# EAGLE board tablet (EAGLE 8.4.3), part 1 of 5
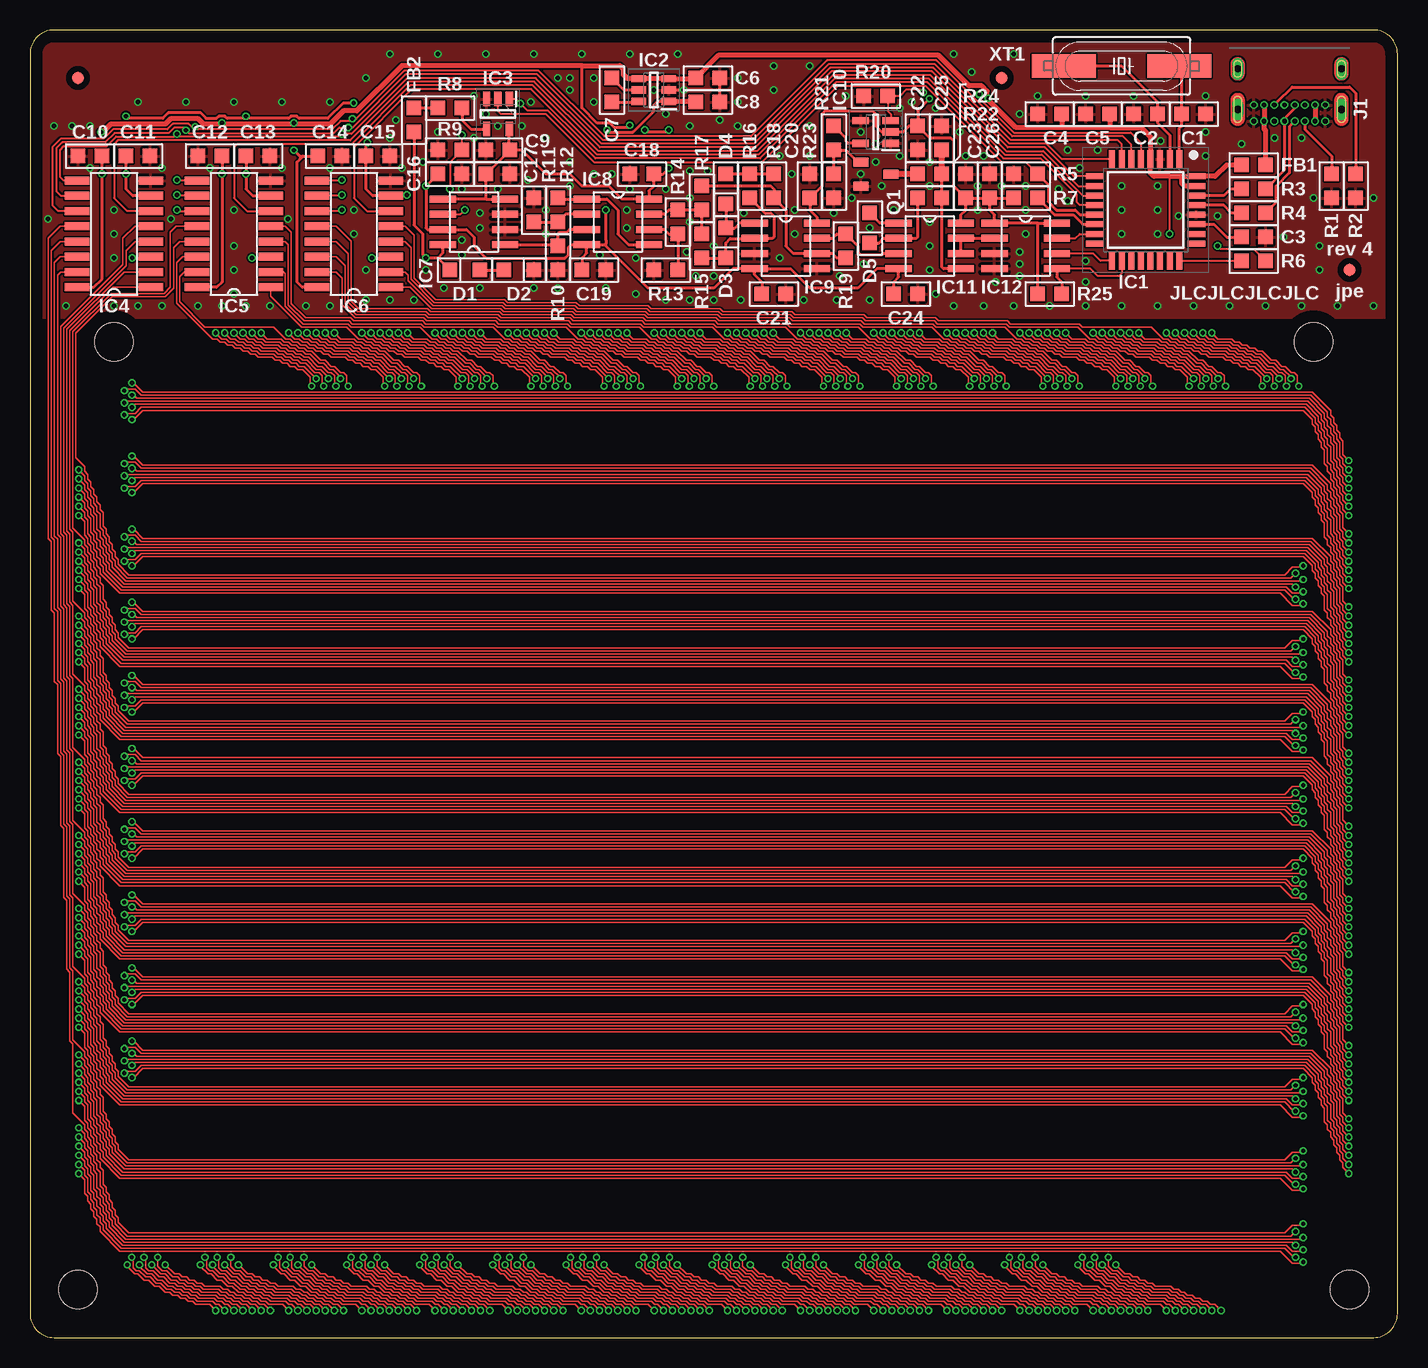
[diagram p5: board, top side]
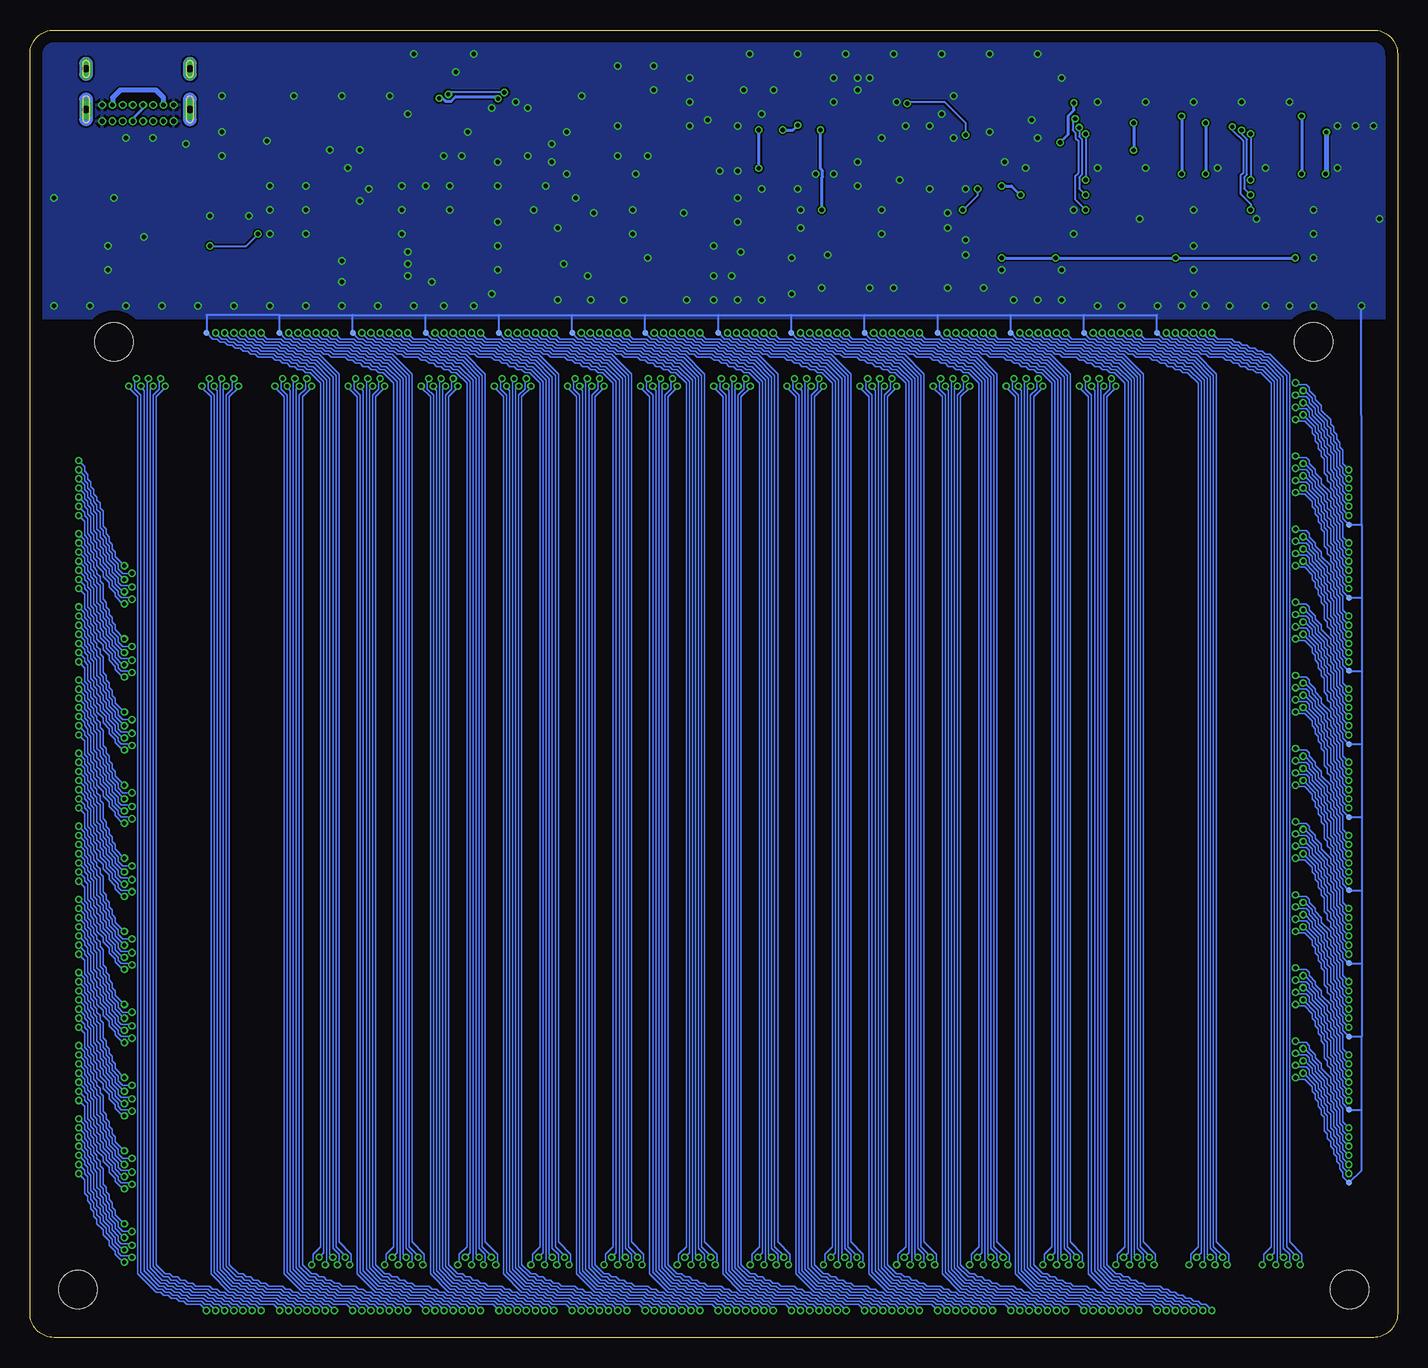
[diagram p6: board, bottom side, seen from below]

Size 114 x 109 mm. Coordinates in mm from the lower left corner, seen from the top.
Outline: 112,109 2,109 arc90 0,107 0,2 arc90 2,0 112,0 arc90 114,2 114,107 arc90 112,109
Copper layers (1*16): Top 0.035mm / dielectric 1.5mm / Bottom 0.035mm
Design rules "default *": minimum track width 5mil, minimum drill 0.35mm, track to track 5mil, track to pad 5mil, pad to pad 5mil, via to via 5mil, smd to smd 0mil, copper to edge 40mil, drill to drill 6mil, minimum pad ring 5mil, minimum via ring 5mil, stop-mask expansion 4mil, vias tented up to drill 14mil, thermal gap 10mil
Net classes: 0 default: width 0.152 mm, clearance 0.152 mm; 1 coil: width 0.127 mm, clearance 0.127 mm
Holes 3.2 mm at 110,4 4,4 7,83 107,83

## Footprints (pad centres in the part's own frame; a part is rotated, then mirrored left to right if it is on the bottom)
0805 = smd 1.2 x 1.2: 1 -1,0; 2 1,0
SOD323 = smd 1.2 x 1.2: 1 -1.25,0; 2 1.25,0
FIDUCIAL = smd 1 x 1: SPOT 0,0
QFP80P900X900X120-32N = smd 1.5 x 0.5: 1 -4.238,2.8; 2 -4.238,2; 3 -4.238,1.2; 4 -4.238,0.4; 5 -4.238,-0.4; 6 -4.238,-1.2; 7 -4.238,-2; 8 -4.238,-2.8; 17 4.238,-2.8; 18 4.238,-2; 19 4.238,-1.2; 20 4.238,-0.4; 21 4.238,0.4; 22 4.238,1.2; 23 4.238,2; 24 4.238,2.8 | smd 0.5 x 1.5: 9 -2.8,-4.238; 10 -2,-4.238; 11 -1.2,-4.238; 12 -0.4,-4.238; 13 0.4,-4.238; 14 1.2,-4.238; 15 2,-4.238; 16 2.8,-4.238; 25 2.8,4.238; 26 2,4.238; 27 1.2,4.238; 28 0.4,4.238; 29 -0.4,4.238; 30 -1.2,4.238; 31 -2,4.238; 32 -2.8,4.238
SOT95P280X145-6N = smd 1.2 x 0.6: 1 -1.25,0.95; 2 -1.25,0; 3 -1.25,-0.95; 4 1.25,-0.95; 5 1.25,0; 6 1.25,0.95
SOT95P280X145-5N = smd 1.2 x 0.6: 1 -1.25,0.95; 2 -1.25,0; 3 -1.25,-0.95; 4 1.25,-0.95; 5 1.25,0.95
SO16 = smd 0.66 x 2.032: 1 -4.445,-3.073; 2 -3.175,-3.073; 3 -1.905,-3.073; 4 -0.635,-3.073; 5 0.635,-3.073; 6 1.905,-3.073; 7 3.175,-3.073; 8 4.445,-3.073; 9 4.445,3.073; 10 3.175,3.073; 11 1.905,3.073; 12 0.635,3.073; 13 -0.635,3.073; 14 -1.905,3.073; 15 -3.175,3.073; 16 -4.445,3.073
SOIC8 = smd 0.6 x 2.2: 1 -1.905,-2.6; 2 -0.635,-2.6; 3 0.635,-2.6; 4 1.905,-2.6; 5 1.905,2.6; 6 0.635,2.6; 7 -0.635,2.6; 8 -1.905,2.6
SOT95P270X145-5N = smd 1.4 x 0.6: 1 -1.25,0.95; 2 -1.25,0; 3 -1.25,-0.95; 4 1.25,-0.95; 5 1.25,0.95
USB4085-GF-A = drill 0.4 pad 0.65: A1 2.975,-6.1; A4 2.125,-6.1; A5 1.275,-6.1; A6 0.425,-6.1; A7 -0.425,-6.1; A8 -1.275,-6.1; A9 -2.125,-6.1; A12 -2.975,-6.1; B1 -2.975,-4.75; B4 -2.125,-4.75; B5 -1.275,-4.75; B6 -0.425,-4.75; B7 0.425,-4.75; B8 1.275,-4.75; B9 2.125,-4.75; B12 2.975,-4.75 | drill 0.6 pad 0.9 long: S1 4.325,-5.12; S2 -4.325,-5.12; S3 -4.325,-1.74; S4 4.325,-1.74
SOT23_3 = smd 0.75 x 1.25: P$1 -1,-1.25; P$2 1,-1.25; P$3 0,1.25
2P = smd 0.508 x 0.508: 1 0,0; 2 0,0
HC49UP = smd 5.334 x 1.93: 1 -4.826,0; 2 4.826,0

## Placement (x,y rotation side)
C1  18pF  [0805]  97,102 0 top
C2  18pF  [0805]  93,102 180 top
C3  1uF  [0805]  102,91.75 180 top
C4  4.7uF  [0805]  85,102 180 top
C5  100nF  [0805]  89,102 180 top
C6  4.7uF  [0805]  56.5,105 0 top
C7  1uF  [0805]  48.5,104 270 top
C8  4.7uF  [0805]  56.5,103 180 top
C9  100nF  [0805]  39,99 180 top
C10  100nF  [0805]  5,98.5 180 top
C11  100nF  [0805]  9,98.5 180 top
C12  100nF  [0805]  15,98.5 180 top
C13  100nF  [0805]  19,98.5 180 top
C14  100nF  [0805]  25,98.5 0 top
C15  100nF  [0805]  29,98.5 180 top
C16  100nF  [0805]  35,97 0 top
C17  100nF  [0805]  39,97 0 top
C18  100nF  [0805]  51,97 180 top
C19  100nF  [0805]  47,89 180 top
C20  100nF  [0805]  65,96 90 top
C21  100nF  [0805]  62,87 180 top
C22  1uF  [0805]  74,100 270 top
C23  100nF  [0805]  78,96 90 top
C24  100nF  [0805]  73,87 180 top
C25  1nF C0G  [0805]  76,100 90 top
C26  100nF  [0805]  80,96 90 top
D1  5.1V Z  [SOD323]  36.25,89 180 top
D2  5.1V Z  [SOD323]  40.75,89 0 top
D3  1PS76SB70  [SOD323]  58,91.25 270 top
D4  1PS76SB70  [SOD323]  58,95.75 270 top
D5  1PS76SB70  [SOD323]  70,92.5 270 top
FB1  1K  [0805]  102,97.75 0 top
FB2  1K  [0805]  32,101.5 90 top
FD1  [FIDUCIAL]  4,105 0 top
FD2  [FIDUCIAL]  110,89 0 top
FD3  [FIDUCIAL]  81,105 0 top
IC1  ATMEGA16U2-AU  [QFP80P900X900X120-32N]  93,94 270 top
IC2  LM2776DBVR  [SOT95P280X145-6N]  52,104 180 top
IC3  SN74LVC1G125DBVT  [SOT95P280X145-5N]  39,102 270 top
IC4  4051D  [SO16]  7,92 90 top
IC5  4051D  [SO16]  17,92 90 top
IC6  4051D  [SO16]  27,92 90 top
IC7  DG419LEDY-T1-GE4  [SOIC8]  37,93 90 top
IC8  TSH82IDT  [SOIC8]  49,93 270 top
IC9  TSH82IDT  [SOIC8]  63,91 270 top
IC10  MCP1402T-E_OT  [SOT95P270X145-5N]  70.5,100.5 180 top
IC11  TSH82IDT  [SOIC8]  75,91 270 top
IC12  MCP3201  [SOIC8]  83,91 270 top
J1  USB4085-GF-A  [USB4085-GF-A]  105,107.5 0 top
Q1  BSS806NEH6327XTSA1  [SOT23_3]  70.5,97 270 top
R1  5.1K  [0805]  108.5,96 270 top
R2  5.1K  [0805]  110.5,96 270 top
R3  22R  [0805]  102,95.75 180 top
R4  22R  [0805]  102,93.75 180 top
R5  10K  [0805]  83,97 0 top
R6  10K  [0805]  102,89.75 0 top
R7  10K  [0805]  83,95 180 top
R8  150R  [0805]  35,102.5 180 top
R9  10K  [0805]  35,99 0 top
R10  10K  [0805]  44,90 90 top
R11  2.21K  [0805]  42,94 270 top
R12  27K  [0805]  44,94 90 top
R13  2.21K  [0805]  53,89 0 top
R14  27K  [0805]  54,93 90 top
R15  2.21K  [0805]  56,91 270 top
R16  2.21K  [0805]  60,96 90 top
R17  4.42K  [0805]  56,95 90 top
R18  2.21K  [0805]  62,96 90 top
R19  4.42K  [0805]  68,91 90 top
R20  10K  [0805]  70.5,103.5 0 top
R21  1R  [0805]  67,100 270 top
R22  22R  [0805]  75,95 0 top
R23  10K  [0805]  67,96 270 top
R24  1R  [0805]  75,97 0 top
R25  10K  [0805]  85,87 180 top
X0  2P  [2P]  99.29,83.75 0 bottom
X1  2P  [2P]  93.19,83.75 0 bottom
X2  2P  [2P]  87.1,83.75 0 bottom
X3  2P  [2P]  81,83.75 0 bottom
X4  2P  [2P]  74.91,83.75 0 bottom
X5  2P  [2P]  68.81,83.75 0 bottom
X6  2P  [2P]  62.72,83.75 0 bottom
X7  2P  [2P]  56.62,83.75 0 bottom
X8  2P  [2P]  50.52,83.75 0 bottom
X9  2P  [2P]  44.43,83.75 0 bottom
X10  2P  [2P]  38.33,83.75 0 bottom
X11  2P  [2P]  32.23,83.75 0 bottom
X12  2P  [2P]  26.14,83.75 0 bottom
X13  2P  [2P]  20.04,83.75 0 bottom
XT1  12MHz  [HC49UP]  91,106 0 top
Y0  2P  [2P]  4.06,12.9 0 bottom
Y1  2P  [2P]  4.06,19 0 bottom
Y2  2P  [2P]  4.06,25.09 0 bottom
Y3  2P  [2P]  4.06,31.19 0 bottom
Y4  2P  [2P]  4.06,37.28 0 bottom
Y5  2P  [2P]  4.06,43.38 0 bottom
Y6  2P  [2P]  4.06,49.48 0 bottom
Y7  2P  [2P]  4.06,55.57 0 bottom
Y8  2P  [2P]  4.06,61.67 0 bottom
Y9  2P  [2P]  4.06,67.77 0 bottom

## Tracks (layer width: path | path; a pad name or v marks a point on that pad's centre or on a via)
+5V  (via drill 0.35)
  Top 0.152: R6.2 102,90.75 99.25,90.75 v99,91 | v95,92 95,96.8
  Top 0.254: C26.1 80,94 80.4,93.6 IC12.1 84,92.91 | 85.75,93.06 IC12.8 84,92.91 | C23.1 78,94 77.6,93.6 IC11.8 | C22.1 73.25,101 72.75,100.5 IC10.2 71,100.5 70.5,101 70.5,102 70.25,102.25 66.25,102.25 66,102 66,96 C20.1 65,94 65.6,93.4 IC9.8 | R25.2 84,92.91 | 38,94.91 IC7.4 | 38,94.91 IC7.5 | 38,94.91 C17.1 C9.1 | C9.1 39.95,99.05 IC3.5 | IC4.16 5.3,87.56 6,88.25 v6,97 C10.1 | C12.1 v16,97 16,88 15.55,87.56 IC5.16 | 22.75,98.5 C14.1 | 22.5,98.25 22.75,98.5 | 22.5,98.25 22.25,98 22.25,88 22.7,87.56 IC6.16 | 16,101.15 v16,101.25 | 22,101.15 v22,101.25 | 22.75,98.5 22.47,98.5 v22,98.97 22.5,98.47 22.5,98.25 | C9.1 41,99 43,97 45,97 46,96 48.25,96 49.34,94.91 IC8.8 51.6,95.6 52,96 C18.1 52.78,97 v53.25,97.47 | C23.1 C26.1 | C26.1 R7.2 | C23.1 77,96 77,99.75 76.75,100 75,100 C22.1 | 80.03,103.03 80.03,103.17 v79.88,103.31 | v74.99,103.26 74,102.28 C22.1 | 46,106.03 46,102.52 47.27,101.25 48.34,101.25 48.69,100.9 49.83,100.9 v50,101.07 | v51.25,100.66 51.42,100.49 53.08,100.49 v53.25,100.66
  Top 0.406: v5.92,100.47 6.07,100.47 6.75,101.15 11.27,101.15 11.72,101.6 14.04,101.6 14.49,101.15 16,101.15 22,101.15 25.02,101.15 26.13,102.26 27.24,102.26 31.02,106.03 46,106.03 49.17,106.03 49.46,105.75 49.46,105.29 49.8,104.95 IC2.4 IC2.3 55.45,104.95 C6.1 57.39,106.89 75.73,106.89 78.28,104.35 79.35,104.35 79.79,103.91 79.79,103.27 80.03,103.03 82.19,100.87 86,100.87 | 96,96.8 IC1.32 98.8,96.8 99.75,97.75 FB1.1 | 96,96.8 95,96.8 93.7,96.8 93.4,97.1 IC1.4 93.4,100.1 92.63,100.87 90,100.87 | IC1.31 96.25,96 96,96.25 96,96.8 | 90,100.87 86,100.87 | C4.1 86,100.87 | C5.1 90,100.87
  Bottom 0.152: v99,91 96,91 v95,92
  Bottom 0.254: v16,101.25 v16,97 | v22,101.25 v22,98.97 | v79.88,103.31 79.64,103.31 79.38,103.05 78.89,103.05 78.5,103.44 75.17,103.44 v74.99,103.26 | v53.25,97.47 v53.25,100.66 | v51.25,100.66 50.41,100.66 v50,101.07
  Bottom 0.406: v5.92,100.47 5.92,97.08 v6,97
-5V  (via drill 0.35)
  Top 0.254: C24.2 72,88 72.4,88.4 IC11.4 70.59,89.09 69,87.5 65,87.5 63.41,89.09 IC9.4 | IC9.4 60.4,88.6 61,88 C21.2 | C19.2 46,90 46.4,90.4 IC8.4 | C16.1 v33,96 33,92.5 33.13,92.36 IC7.7 36.38,92.36 37,91.75 37,91 38,90 44.59,90 44.88,90.28 44.88,90.88 45.09,91.09 IC8.4 | C13.2 v18,97 18,95.75 18.57,95.17 IC5.7 | C11.2 v8,97 8,95.75 8.57,95.17 IC4.7 | IC8.4 47.91,91.09 | 47.91,91.09 48,91 | 48,91 51.5,87.5 57,87.5 58.59,89.09 IC9.4 | v31.42,95.25 31.34,95.17 IC6.7 28.57,95.17 28,95.75 C15.2 28,99.5 v28.12,99.62 | v26.97,102.92 26.11,102.92 24.82,101.63 22.44,101.63 22.24,101.83 21.76,101.83 21.56,101.63 18.18,101.63 v18,101.81 17.82,101.63 16.44,101.63 16.24,101.83 15.76,101.83 15.56,101.63 14.69,101.63 14.23,102.08 11.53,102.08 11.07,101.63 8.18,101.63 v8,101.81 | 47.91,91.09 48,91.19 | v48.1,100.66 48.28,100.49 50.25,100.49 52,102.24 52,102.75 52.3,103.05 IC2.1 | 48,91.19 48,91.5 v48,94 | 48,91 48,91.19
  Top 0.406: IC2.1 55.45,103.05 C8.2
  Bottom 0.254: v33,96 32.17,96 v31.42,95.25 | v26.97,102.92 26.97,102.33 27.46,101.84 27.46,100.29 v28.12,99.62 | v18,101.81 v18,97 | v8,101.81 v8,97 | v48.1,100.66 48.1,97.43 47.92,97.24 47.92,96.76 48,96.68 v48,94
CS_ADC
  Top 0.152: IC1.18 91,88.75 90.75,88.5 89,88.5 88.41,89.09 IC12.5
  Top 0.254: IC12.5 85.6,88.4 86,88 R25.1
ENA
  Top 0.152: IC1.9 87.02,96.8 84.6,99.22 81.5,99.22 75.18,105.55 66.82,105.55 60.49,99.22 47.51,99.22 42.04,104.69 31.58,104.69 26.69,99.81 7.3,99.81 7,99.5 7,95 8.1,93.91 IC4.6
ENB
  Top 0.152: IC5.6 18.09,93.91 17,95 17,99.25 17.25,99.5 26.82,99.5 31.7,104.38 41.91,104.38 47.38,98.91 60.62,98.91 66.95,105.24 75.05,105.24 81.38,98.91 84.47,98.91 87.39,96 IC1.10
ENC
  Top 0.152: IC6.6 28.09,93.91 27,95 27,99.25 31.83,104.08 41.78,104.08 47.25,98.61 60.75,98.61 67.08,104.94 74.92,104.94 81.25,98.61 84.34,98.61 87.75,95.2 IC1.11
GND  (via drill 0.35)
  Top 0.254: 57.5,104 v54.5,104 IC2.2 | 57.5,104 C6.2 | C8.1 57.5,104
  Bottom 0.152: 3,19 3,25.09 | 3,31.19 3,25.09 | 3,37.28 3,31.19 | 3,43.38 3,37.28 | 3,49.48 3,43.38 | 3,55.57 3,49.48 | 3,61.67 3,55.57 | 3,67.77 3,61.67 | 3,67.77 v3.01,86 | Y1.2 3,19 | Y2.2 3,25.09 | Y3.2 3,31.19 | Y4.2 3,37.28 | Y5.2 3,43.38 | Y6.2 3,49.48 | Y7.2 3,55.57 | Y8.2 3,61.67 | Y9.2 3,67.77 | X0.2 99.29,85.25 93.19,85.25 | X13.2 20.04,85.25 26.14,85.25 | 32.23,85.25 26.14,85.25 | 38.33,85.25 32.23,85.25 | 44.43,85.25 38.33,85.25 | 50.52,85.25 44.43,85.25 | 56.62,85.25 50.52,85.25 | 62.72,85.25 56.62,85.25 | 68.81,85.25 62.72,85.25 | 74.91,85.25 68.81,85.25 | 81,85.25 74.91,85.25 | 87.1,85.25 81,85.25 | 93.19,85.25 87.1,85.25 | X12.2 26.14,85.25 | X11.2 32.23,85.25 | X10.2 38.33,85.25 | X9.2 44.43,85.25 | X8.2 50.52,85.25 | X7.2 56.62,85.25 | X6.2 62.72,85.25 | X5.2 68.81,85.25 | X4.2 74.91,85.25 | X3.2 81,85.25 | X2.2 87.1,85.25 | X1.2 93.19,85.25 | Y0.2 3,13.96 3,19
  other vias: 7,86 9,86 11,86 14,86 16,86 20,86 28,86.5 30,86.5 32,86.5 25,86 23,86 5,97.5 11,97.5 15,97.5 21,97.5 25,97.5 30,100 31,97.5 34,100.5 37,100 39,101 38,102 41.5,96.5 48.5,97 47,97 34.5,87.5 37.5,87.5 42,87.5 44,87.5 48,87.5 50.5,90 36,95.75 62.5,90 68,103.5 65,98.5 63.5,97 69.25,97 70.5,99.5 69.25,100.5 71,96 68.5,95 67,93.75 50.5,87 53,86.5 55,86.5 57,86.5 59.25,86.5 64.5,86.5 67.25,86.5 70,86.5 75.5,87 75.5,102.5 77.5,100.5 72.5,98.5 78,98.5 79.5,98.5 79,96 81,96 83,96 82.5,90.5 82.5,89.5 82.5,88.5 77,86 79.5,86 82,86 85,86 88,86 91,86 94,86 97,86 100,86 103,86 106,86 109,86 112,86 37.5,92.5 37.5,93.75 43,100 45,98 41,101 41.75,103 88,89.75 86.5,99 89,99 82.5,102 84,103.5 88,103.5 92,103.5 98,103.5 98,100.5 98,98.5 101,99.5 95.75,93.5 99,93.5 91,92 94,92 94,94 94,96 91,96 91,94 75,93 75,91 75,89 63.75,94 63.75,92 18,86 1.5,93.25 7,90 7,92 7,94 17,94 17,91 17,89 17,87 11.75,93.25 21.5,93.25 27,92 28,89 27,94 9,103 13,103 17,103 21,103 25,103 30.5,101.5 28,105 30,107 34,107 38,107 42,107 46,107 50,107 44,105 47,105 47,103 52,104 54,107 53,102 55,101 57.5,101.5 59,103 59,105 62,104 62,106 65,106 59,101 65,101 62.5,98.5 75,98 75,96 72,94 79,94 83,94 83,92 80.5,88 88,88 107,95 112,95 77,107 78.5,105.5 82,107 73.5,103 72.5,102.5 70.5,98 70,92.5 67.5,88.5 69.5,89.5 55.5,88.5 57,88.5 57,91 54.75,90.5 55,93 55,95 53,95.75 55,97.25 56.5,97.25 59.5,93.75 49.75,94 49.75,92.5 45,96 50,95.75 39,95.75 43,94 43,92 47.5,90.25 32.75,98 36,91.5 36,90.25 33,89 2,101 3.5,101 5,101 45,105 45,104 104.5,91.75 107.5,91 107.5,89 94.25,99.75 87.5,97.5 103.75,100 106,100 85.75,95.75 86.5,94.75 37,103.5
  pour Bottom: 0,109 114,109 114,85 0,85
  pour Top: 0,109 114,109 114,85 0,85
MISO
  Top 0.152: IC12.6 88.64,90.36 89.24,89.76 IC1.17
N$1
  Top 0.254: IC1.1 95.8,100.8 96,101 C1.1 96,105.83 XT1.2
N$2
  Top 0.254: D1.1 D2.1
N$3
  Top 0.254: R8.1 36,101.5 36.75,100.75 IC3.4
N$4
  Top 0.254: IC8.2 44.63,93.64 R12.1 R11.2
N$5
  Top 0.254: R24.2 R22.2 76,89.25 76.16,89.09 IC11.5
  Top 0.508: R24.2 C25.1
N$6
  Top 0.254: IC1.27 98.7,92.8 99.75,91.75 C3.2
N$7
  Top 0.254: IC1.2 95,100.25 94,101.25 C2.1 94,103 91,106 XT1.1
N$8
  Top 0.406: J1.B4 J1.A9 102.88,100.75 103,100.62 FB1.2 | J1.B9 J1.A4
  Bottom 0.406: J1.B4 102.88,103.38 103.5,104 106.5,104 107.12,103.38 J1.B9
N$9
  Top 0.254: R15.1 R17.1 R14.2 53.25,94 52.88,93.64 IC8.7
N$11
  Top 0.254: R12.2 44.09,94.91 IC8.1 48.09,94.91 49,94 49,92 49.91,91.09 IC8.5
N$12
  Top 0.254: R16.1 61.25,93.75 61.75,93.75 62,93.5 62,91.75 61.88,91.64 IC9.2 60.39,91.62 58.37,91.62 58,91.25 D3.2 R15.2
N$13
  Top 0.254: J1.A5 106.28,100.72 108.5,98.5 R1.1
N$14
  Top 0.254: IC8.6 52.88,92.36 53.25,92 R14.1 R13.2
N$15
  Top 0.254: J1.B5 103.97,102.99 103.97,103 105.22,104.25 110,104.25 110.5,103.75 R2.1
N$18
  Top 0.254: IC9.1 59.16,92.91 58.75,92.5 D3.1 D4.2
N$19
  Top 0.254: R18.2 R16.2 D4.1
N$20
  Top 0.254: R19.1 67.25,90 66.89,90.36 IC9.6 63.63,90.36 63,91 63,94 R18.1 62,95.75 61.75,96 R17.2
N$22
  Top 0.254: Q1.P$1 69,98 68,99 R21.2 R23.1
N$23
  Top 0.254: IC11.1 70.84,92.91 D5.1
N$24
  Top 0.254: IC9.7 66.89,91.64 67.25,92 R19.2 69,91 69,90.5 69.25,90.25 71,90.25 71.11,90.36 IC11.3
N$25
  Top 0.254: D5.2 70.75,91.25 71.14,91.64 IC11.2 73.89,91.64 74,91.75 R22.1
N$26
  Top 0.254: R7.1 85.41,93.59 86.96,93.59 87.75,92.8 IC1.14
N$27
  Top 0.152: IC1.24 100.99,89.76 R6.1
N$28
  Top 0.254: IC11.6 IC11.7 IC12.2
N$29
  Top 0.254: IC1.29 99.5,94.4 100.15,93.75 R4.2
N$30
  Top 0.254: IC8.3 44.96,92.36 44.72,92.12 44.12,92.12 44,92 R10.2 43.91,91.09 IC7.1
N$31
  Top 0.254: IC1.30 99.5,95.2 100.05,95.75 R3.2
N$32
  Top 0.254: R3.1 104.58,97.33 J1.A7 104.58,101.62 105.42,102.47 J1.B7
N$33
  Top 0.254: R4.1 103.88,94.63 103.88,96 104.98,97.1 104.98,100.95 105.18,101.15 105.18,101.16 J1.A6
  Bottom 0.254: J1.B6 104.58,102.47 105.42,101.62 J1.A6
N$34
  Top 0.254: 72,97 Q1.P$3
  Top 0.508: R24.1 72,97
N$35
  Top 0.254: IC10.5 68.2,99.55 68,99.75 68,100 R21.1
N$36
  Top 0.254: IC2.5 49.5,104 C7.1
N$37
  Top 0.254: C7.2 50.7,103 IC2.6
N$39
  Top 0.254: R8.2 FB2.2
OUT
  Top 0.152: R5.2 83,98 81,98 74.67,104.33 67.33,104.33 61,98 47,98 43,102 39.25,102 39,102.25 IC3.2
  Top 0.254: IC1.13 87.53,93.6 87.13,93.99 85.58,93.99 84.88,94.69 84.88,96.12 R5.2
OUT_OE  (via drill 0.35)
  Top 0.152: IC3.1 40.5,103.25 v40.88,102.88 41.45,102.31 43.13,102.31 47.13,98.31 60.87,98.31 67.2,104.63 74.8,104.63 81.13,98.31 84.22,98.31 87.25,95.27 87.25,94.65 87.5,94.4 IC1.12 | v35,95.75 35,98 R9.2 v36,100.25 | IC7.6 35.87,93.64 v36.25,94
  Bottom 0.152: v35,95.75 35,95.25 v36.25,94 | v36,100.25 36,101.25 37.75,103 40.75,103 v40.88,102.88
PEAK_DRAIN  (via drill 0.35)
  Top 0.152: v79.13,103.63 79.13,103.31 82.01,100.44 91.75,100.44 92.6,99.59 IC1.5 | v74.45,103.8 74.23,104.02 73.02,104.02 72.5,103.5 R20.2 71.5,102.25 71.75,102 IC10.3
  Bottom 0.152: v74.45,103.8 78.97,103.8 v79.13,103.63
S0  (via drill 0.35)
  Top 0.152: IC1.6 91.8,99.45 91.12,100.13 81.88,100.13 75.56,106.46 66.44,106.46 60.12,100.13 47.88,100.13 42.41,105.6 31.2,105.6 27.19,101.6 v26.88,101.6 26.67,101.4 25.88,101.4 25.2,100.72 14,100.72 | v26,94 25.91,93.91 IC6.11 | IC4.11 2.35,93.91 1.89,94.36 1.89,99.25 2.58,99.94 6.14,99.94 6.93,100.72 11.45,100.72 11.9,101.17 13.23,101.17 13.68,100.72 14,100.72 | 14,100.72 13.77,100.94 v13.76,100.94 | v12.25,94 12.35,93.91 IC5.11
  Bottom 0.152: v26,94 26.84,94.83 26.84,96.85 26.61,97.07 26.61,99.76 26.84,100 26.84,100.42 27.07,100.65 27.07,101.41 v26.88,101.6 | v12.25,94 12.25,94.5 13.09,95.33 13.09,96.85 12.86,97.07 12.86,99.76 13.21,100.11 13.23,100.11 13.76,100.65 v13.76,100.94
S1  (via drill 0.35)
  Top 0.152: v26,95.25 25.93,95.17 IC6.10 | IC5.10 12.32,95.17 v12.25,95.25 | IC4.10 2.58,95.17 2.19,95.56 2.19,99.13 2.7,99.63 6.27,99.63 7.05,100.41 11.58,100.41 12.03,100.87 12.78,100.87 v13.01,100.64 13.23,100.41 25.33,100.41 25.78,100.87 v26.54,100.87 26.89,100.87 31.32,105.3 42.29,105.3 47.76,99.83 60.24,99.83 66.57,106.16 75.43,106.16 81.76,99.83 90.67,99.83 91,99.5 IC1.7
  Bottom 0.152: v26.54,100.87 26.54,100.12 26.3,99.89 26.3,96.95 26.53,96.72 26.53,95.78 v26,95.25 | v12.25,95.25 12.78,95.78 12.78,96.72 12.55,96.95 12.55,99.89 13.01,100.34 v13.01,100.64
S2  (via drill 0.35)
  Top 0.152: IC1.8 86.01,98.24 84.72,99.52 81.63,99.52 75.3,105.85 66.7,105.85 60.37,99.52 47.63,99.52 42.16,104.99 31.45,104.99 26.79,100.33 v26,100.33 25.77,100.11 12.48,100.11 v12.25,100.33 12.02,100.11 7.18,100.11 6.4,99.33 2.83,99.33 2.5,99 2.5,96.75 2.81,96.44 IC4.9 | v26,96.5 25.95,96.44 IC6.9 | v12.25,96.5 13.87,96.5 IC5.9
  Bottom 0.152: v26,100.33 v26,96.5 | v12.25,100.33 v12.25,96.5
SCLK
  Top 0.152: IC12.7 87.14,91.64 87.5,92 IC1.15
SIGNAL  (via drill 0.35)
  Top 0.254: IC7.8 34.4,90.4 34,90 | 34,90 v33,90 32.75,90.25 32.75,92 32,92.75 FB2.1 | v28.5,90 29.98,90 IC6.3 | v18.5,90 19.98,90 IC5.3 | v8.52,90 9.98,90 IC4.3 | D1.2 34,90
  Bottom 0.254: v33,90 v28.5,90 v18.5,90 v8.52,90
X0  (via drill 0.35 pad 0.6)
  Top 0.127: v88.75,6.69 88.88,6.57 88.88,5.8 89.13,5.55 89.51,5.55 90.02,5.04 90.4,5.04 90.91,4.54 91.29,4.54 91.54,4.28 91.92,4.28 92.18,4.03 92.56,4.03 92.81,3.77 93.19,3.77 93.45,3.52 94.72,3.52 94.97,3.26 95.35,3.26 95.61,3.01 95.86,3.01 96.12,2.76 96.5,2.76 v97,2.25 | v87.73,6.69 87.86,6.57 87.86,5.8 88.11,5.55 88.37,5.55 88.88,5.04 89.26,5.04 89.77,4.54 90.15,4.54 90.66,4.03 91.04,4.03 91.29,3.77 91.67,3.77 91.92,3.52 92.31,3.52 92.56,3.26 92.94,3.26 93.19,3.01 94.47,3.01 94.72,2.76 94.97,2.76 v95.48,2.25 | v87.35,6.06 87.35,5.93 87.99,5.3 88.24,5.3 88.75,4.79 89.13,4.79 89.64,4.28 90.02,4.28 90.53,3.77 90.91,3.77 91.16,3.52 91.54,3.52 91.8,3.26 92.18,3.26 92.43,3.01 92.81,3.01 93.07,2.76 94.21,2.76 v94.72,2.25 | v96.24,2.25 95.73,2.76 95.48,2.76 95.23,3.01 94.85,3.01 94.59,3.26 93.32,3.26 93.07,3.52 92.69,3.52 92.43,3.77 92.05,3.77 91.8,4.03 91.42,4.03 91.16,4.28 90.78,4.28 90.27,4.79 89.89,4.79 89.39,5.3 89,5.3 88.37,5.93 v88.37,6.06 | v97.77,2.25 97.26,2.76 96.88,2.76 96.62,3.01 96.24,3.01 95.99,3.26 95.73,3.26 95.48,3.52 95.1,3.52 94.85,3.77 93.58,3.77 93.32,4.03 92.94,4.03 92.69,4.28 92.31,4.28 92.05,4.54 91.67,4.54 91.42,4.79 91.04,4.79 90.53,5.3 90.15,5.3 v89.39,6.06 | v98.53,2.25 98.02,2.76 97.64,2.76 97.39,3.01 97,3.01 96.75,3.26 96.37,3.26 96.12,3.52 95.86,3.52 95.61,3.77 95.23,3.77 94.97,4.03 93.7,4.03 93.45,4.28 93.07,4.28 92.81,4.54 92.43,4.54 92.18,4.79 91.8,4.79 91.54,5.04 91.16,5.04 90.66,5.55 90.27,5.55 89.89,5.93 v89.89,6.69 | v102.72,79.31 102.59,79.43 102.59,80.07 101.96,80.7 101.58,80.7 101.32,80.96 100.94,80.96 100.69,81.21 100.31,81.21 100.05,81.47 99.67,81.47 99.42,81.72 98.28,81.72 98.02,81.97 97.64,81.97 97.39,82.23 97,82.23 96.75,82.48 96.37,82.48 96.12,82.74 95.73,82.74 95.48,82.99 95.1,82.99 94.85,83.24 94.47,83.24 93.47,84.24 87.73,84.24 87.47,84.5 81.74,84.5 81.48,84.75 75.75,84.75 75.49,85.01 69.75,85.01 69.5,85.26 63.77,85.26 63.51,85.51 57.77,85.51 57.52,85.77 51.78,85.77 51.53,86.02 45.79,86.02 45.54,86.28 39.8,86.28 39.55,86.53 33.81,86.53 32.01,88.33 32.01,91.89 31.26,92.64 IC6.5
  Top 0.127: v103.74,79.31 103.61,79.43 103.61,80.19 103.36,80.45 102.97,80.45 102.21,81.21 101.83,81.21 101.58,81.47 101.2,81.47 100.94,81.72 100.56,81.72 100.31,81.97 99.93,81.97 99.67,82.23 98.53,82.23 98.28,82.48 97.89,82.48 97.64,82.74 97.26,82.74 97,82.99 96.62,82.99 96.37,83.24 95.99,83.24 v95.48,83.75 | v104.75,79.31 104.62,79.43 104.62,80.19 104.37,80.45 104.12,80.45 103.61,80.96 103.23,80.96 102.47,81.72 102.08,81.72 101.83,81.97 101.45,81.97 101.2,82.23 100.81,82.23 100.56,82.48 100.18,82.48 99.93,82.74 98.78,82.74 98.53,82.99 98.15,82.99 97.89,83.24 97.51,83.24 v97,83.75 | v105.13,79.94 105.13,80.07 104.5,80.7 104.24,80.7 103.74,81.21 103.36,81.21 102.59,81.97 102.21,81.97 101.96,82.23 101.58,82.23 101.32,82.48 100.94,82.48 100.69,82.74 100.31,82.74 100.05,82.99 98.91,82.99 98.66,83.24 98.28,83.24 v97.77,83.75 | v96.24,83.75 96.75,83.24 97.13,83.24 97.39,82.99 97.77,82.99 98.02,82.74 98.4,82.74 98.66,82.48 99.8,82.48 100.05,82.23 100.43,82.23 100.69,81.97 101.07,81.97 101.32,81.72 101.7,81.72 101.96,81.47 102.34,81.47 103.1,80.7 103.48,80.7 104.12,80.07 v104.12,79.94 | v94.72,83.75 95.23,83.24 95.61,83.24 95.86,82.99 96.24,82.99 96.5,82.74 96.88,82.74 97.13,82.48 97.51,82.48 97.77,82.23 98.15,82.23 98.4,81.97 99.55,81.97 99.8,81.72 100.18,81.72 100.43,81.47 100.81,81.47 101.07,81.21 101.45,81.21 101.7,80.96 102.08,80.96 v103.1,79.94 | v90.53,6.06 91.29,5.3 91.67,5.3 91.92,5.04 92.31,5.04 92.56,4.79 92.94,4.79 93.19,4.54 93.58,4.54 93.83,4.28 95.1,4.28 95.35,4.03 95.73,4.03 95.99,3.77 96.24,3.77 96.5,3.52 96.88,3.52 97.13,3.26 97.51,3.26 97.77,3.01 98.15,3.01 98.4,2.76 98.78,2.76 v99.29,2.25
  Top 0.127: v105.77,79.31 105.64,79.43 105.64,80.19 105.39,80.45 105.13,80.45 104.62,80.96 104.37,80.96 103.86,81.47 103.48,81.47 102.72,82.23 102.34,82.23 102.08,82.48 101.7,82.48 101.45,82.74 101.07,82.74 100.81,82.99 100.43,82.99 100.18,83.24 99.04,83.24 v98.53,83.75
  Bottom 0.127: v95.48,83.75 94.97,83.24 94.59,83.24 94.34,82.99 93.19,82.99 92.94,82.74 92.56,82.74 92.31,82.48 91.92,82.48 91.67,82.23 91.29,82.23 91.04,81.97 90.66,81.97 90.4,81.72 90.02,81.72 88.5,80.19 88.5,7.58 87.73,6.82 v87.73,6.69 | v96.24,83.75 95.73,83.24 95.35,83.24 95.1,82.99 94.72,82.99 94.47,82.74 93.32,82.74 93.07,82.48 92.69,82.48 92.43,82.23 92.05,82.23 91.8,81.97 91.42,81.97 91.16,81.72 90.78,81.72 90.53,81.47 90.15,81.47 88.75,80.07 88.75,7.46 88.24,6.95 88.24,6.19 v88.37,6.06 | v97,83.75 96.5,83.24 96.12,83.24 95.86,82.99 95.48,82.99 95.23,82.74 94.85,82.74 94.59,82.48 93.45,82.48 93.19,82.23 92.81,82.23 92.56,81.97 92.18,81.97 91.92,81.72 91.54,81.72 91.29,81.47 90.91,81.47 90.66,81.21 90.27,81.21 89,79.94 89,6.95 v88.75,6.69 | v97.77,83.75 97.26,83.24 96.88,83.24 96.62,82.99 96.24,82.99 95.99,82.74 95.61,82.74 95.35,82.48 94.97,82.48 94.72,82.23 93.58,82.23 93.32,81.97 92.94,81.97 92.69,81.72 92.31,81.72 92.05,81.47 91.67,81.47 91.42,81.21 91.04,81.21 90.78,80.96 90.4,80.96 89.26,79.81 89.26,6.19 v89.39,6.06 | v98.53,83.75 98.02,83.24 97.64,83.24 97.39,82.99 97,82.99 96.75,82.74 96.37,82.74 96.12,82.48 95.73,82.48 95.48,82.23 95.1,82.23 94.85,81.97 93.7,81.97 93.45,81.72 93.07,81.72 92.81,81.47 92.43,81.47 92.18,81.21 91.8,81.21 91.54,80.96 91.16,80.96 90.91,80.7 90.53,80.7 89.51,79.69 89.51,7.07 v89.89,6.69 | v94.72,83.75 94.21,83.24 93.07,83.24 92.81,82.99 92.43,82.99 92.18,82.74 91.8,82.74 91.54,82.48 91.16,82.48 90.91,82.23 90.53,82.23 90.27,81.97 89.89,81.97 88.24,80.32 88.24,7.96 87.23,6.95 87.23,6.19 v87.35,6.06
  Bottom 0.127: v97.77,2.25 98.28,2.76 98.66,2.76 98.91,3.01 99.29,3.01 99.55,3.26 100.69,3.26 100.94,3.52 101.32,3.52 101.58,3.77 101.96,3.77 102.21,4.03 102.59,4.03 102.85,4.28 103.23,4.28 104.5,5.55 104.5,78.92 104.75,79.18 v104.75,79.31 | v97,2.25 97.51,2.76 97.89,2.76 98.15,3.01 98.53,3.01 98.78,3.26 99.16,3.26 99.42,3.52 100.56,3.52 100.81,3.77 101.2,3.77 101.45,4.03 101.83,4.03 102.08,4.28 102.47,4.28 102.72,4.54 103.1,4.54 104.24,5.68 104.24,79.81 v104.12,79.94 | v96.24,2.25 96.75,2.76 97.13,2.76 97.39,3.01 97.77,3.01 98.02,3.26 98.4,3.26 98.66,3.52 99.04,3.52 99.29,3.77 100.43,3.77 100.69,4.03 101.07,4.03 101.32,4.28 101.7,4.28 101.96,4.54 102.34,4.54 102.59,4.79 102.97,4.79 103.99,5.8 103.99,79.05 v103.74,79.31 | v95.48,2.25 95.99,2.76 96.37,2.76 96.62,3.01 97,3.01 97.26,3.26 97.64,3.26 97.89,3.52 98.28,3.52 98.53,3.77 98.91,3.77 99.16,4.03 100.31,4.03 100.56,4.28 100.94,4.28 101.2,4.54 101.58,4.54 101.83,4.79 102.21,4.79 102.47,5.04 102.85,5.04 103.74,5.93 103.74,78.54 103.23,79.05 103.23,79.81 v103.1,79.94 | v94.72,2.25 95.23,2.76 95.61,2.76 95.86,3.01 96.24,3.01 96.5,3.26 96.88,3.26 97.13,3.52 97.51,3.52 97.77,3.77 98.15,3.77 98.4,4.03 98.78,4.03 99.04,4.28 100.18,4.28 100.43,4.54 100.81,4.54 101.07,4.79 101.45,4.79 101.7,5.04 102.08,5.04 102.34,5.3 102.72,5.3 103.48,6.06 103.48,78.42 102.72,79.18 v102.72,79.31 | v98.53,2.25 99.04,2.76 99.42,2.76 99.67,3.01 100.81,3.01 101.07,3.26 101.45,3.26 101.7,3.52 102.08,3.52 102.34,3.77 102.72,3.77 102.97,4.03 103.36,4.03 104.75,5.42 104.75,78.54 105.26,79.05 105.26,79.81 v105.13,79.94
  Bottom 0.127: X0.1 98.78,83.24 98.4,83.24 98.15,82.99 97.77,82.99 97.51,82.74 97.13,82.74 96.88,82.48 96.5,82.48 96.24,82.23 95.86,82.23 95.61,81.97 95.23,81.97 94.97,81.72 93.83,81.72 93.58,81.47 93.19,81.47 92.94,81.21 92.56,81.21 92.31,80.96 91.92,80.96 91.67,80.7 91.29,80.7 91.04,80.45 90.66,80.45 89.77,79.56 89.77,7.58 90.4,6.95 90.4,6.19 v90.53,6.06 | v105.77,79.31 105.77,79.18 105.01,78.42 105.01,5.3 103.48,3.77 103.1,3.77 102.85,3.52 102.47,3.52 102.21,3.26 101.83,3.26 101.58,3.01 101.2,3.01 100.94,2.76 99.8,2.76 v99.29,2.25
X1  (via drill 0.35 pad 0.6)
  Top 0.127: v82.65,6.69 82.78,6.57 82.78,5.8 83.03,5.55 83.42,5.55 83.92,5.04 84.31,5.04 84.81,4.54 85.19,4.54 85.45,4.28 85.83,4.28 86.08,4.03 86.46,4.03 86.72,3.77 87.1,3.77 87.35,3.52 88.62,3.52 88.88,3.26 89.26,3.26 89.51,3.01 89.77,3.01 90.02,2.76 90.4,2.76 v90.91,2.25 | v81.64,6.69 81.77,6.57 81.77,5.8 82.02,5.55 82.27,5.55 82.78,5.04 83.16,5.04 83.67,4.54 84.05,4.54 84.56,4.03 84.94,4.03 85.19,3.77 85.58,3.77 85.83,3.52 86.21,3.52 86.46,3.26 86.84,3.26 87.1,3.01 88.37,3.01 88.62,2.76 88.88,2.76 v89.39,2.25 | v81.26,6.06 81.26,5.93 81.89,5.3 82.15,5.3 82.65,4.79 83.03,4.79 83.54,4.28 83.92,4.28 84.43,3.77 84.81,3.77 85.07,3.52 85.45,3.52 85.7,3.26 86.08,3.26 86.34,3.01 86.72,3.01 86.97,2.76 88.11,2.76 v88.62,2.25 | v90.15,2.25 89.64,2.76 89.39,2.76 89.13,3.01 88.75,3.01 88.5,3.26 87.23,3.26 86.97,3.52 86.59,3.52 86.34,3.77 85.96,3.77 85.7,4.03 85.32,4.03 85.07,4.28 84.69,4.28 84.18,4.79 83.8,4.79 83.29,5.3 82.91,5.3 82.27,5.93 v82.27,6.06 | v91.67,2.25 91.16,2.76 90.78,2.76 90.53,3.01 90.15,3.01 89.89,3.26 89.64,3.26 89.39,3.52 89,3.52 88.75,3.77 87.48,3.77 87.23,4.03 86.84,4.03 86.59,4.28 86.21,4.28 85.96,4.54 85.58,4.54 85.32,4.79 84.94,4.79 84.43,5.3 84.05,5.3 v83.29,6.06 | v92.43,2.25 91.92,2.76 91.54,2.76 91.29,3.01 90.91,3.01 90.66,3.26 90.27,3.26 90.02,3.52 89.77,3.52 89.51,3.77 89.13,3.77 88.88,4.03 87.61,4.03 87.35,4.28 86.97,4.28 86.72,4.54 86.34,4.54 86.08,4.79 85.7,4.79 85.45,5.04 85.07,5.04 84.56,5.55 84.18,5.55 83.8,5.93 v83.8,6.69 | v96.62,79.31 96.5,79.43 96.5,80.07 95.86,80.7 95.48,80.7 95.23,80.96 94.85,80.96 94.59,81.21 94.21,81.21 93.96,81.47 93.58,81.47 93.32,81.72 92.18,81.72 91.92,81.97 91.54,81.97 91.29,82.23 90.91,82.23 90.66,82.48 90.27,82.48 90.02,82.74 89.64,82.74 89.39,82.99 89,82.99 88.75,83.24 88.37,83.24 87.37,84.24 81.63,84.24 81.38,84.5 75.64,84.5 75.39,84.75 69.65,84.75 69.4,85.01 63.66,85.01 63.41,85.26 57.67,85.26 57.41,85.51 51.68,85.51 51.42,85.77 45.69,85.77 45.43,86.02 39.7,86.02 39.44,86.28 33.7,86.28 31.76,88.22 31.76,90.86 31.26,91.36 IC6.4
  Top 0.127: v97.64,79.31 97.51,79.43 97.51,80.19 97.26,80.45 96.88,80.45 96.12,81.21 95.73,81.21 95.48,81.47 95.1,81.47 94.85,81.72 94.47,81.72 94.21,81.97 93.83,81.97 93.58,82.23 92.43,82.23 92.18,82.48 91.8,82.48 91.54,82.74 91.16,82.74 90.91,82.99 90.53,82.99 90.27,83.24 89.89,83.24 v89.39,83.75 | v98.66,79.31 98.53,79.43 98.53,80.19 98.28,80.45 98.02,80.45 97.51,80.96 97.13,80.96 96.37,81.72 95.99,81.72 95.73,81.97 95.35,81.97 95.1,82.23 94.72,82.23 94.47,82.48 94.08,82.48 93.83,82.74 92.69,82.74 92.43,82.99 92.05,82.99 91.8,83.24 91.42,83.24 v90.91,83.75 | v99.04,79.94 99.04,80.07 98.4,80.7 98.15,80.7 97.64,81.21 97.26,81.21 96.5,81.97 96.12,81.97 95.86,82.23 95.48,82.23 95.23,82.48 94.85,82.48 94.59,82.74 94.21,82.74 93.96,82.99 92.81,82.99 92.56,83.24 92.18,83.24 v91.67,83.75 | v90.15,83.75 90.66,83.24 91.04,83.24 91.29,82.99 91.67,82.99 91.92,82.74 92.31,82.74 92.56,82.48 93.7,82.48 93.96,82.23 94.34,82.23 94.59,81.97 94.97,81.97 95.23,81.72 95.61,81.72 95.86,81.47 96.24,81.47 97,80.7 97.39,80.7 98.02,80.07 v98.02,79.94 | v88.62,83.75 89.13,83.24 89.51,83.24 89.77,82.99 90.15,82.99 90.4,82.74 90.78,82.74 91.04,82.48 91.42,82.48 91.67,82.23 92.05,82.23 92.31,81.97 93.45,81.97 93.7,81.72 94.08,81.72 94.34,81.47 94.72,81.47 94.97,81.21 95.35,81.21 95.61,80.96 95.99,80.96 v97,79.94 | v84.43,6.06 85.19,5.3 85.58,5.3 85.83,5.04 86.21,5.04 86.46,4.79 86.84,4.79 87.1,4.54 87.48,4.54 87.73,4.28 89,4.28 89.26,4.03 89.64,4.03 89.89,3.77 90.15,3.77 90.4,3.52 90.78,3.52 91.04,3.26 91.42,3.26 91.67,3.01 92.05,3.01 92.31,2.76 92.69,2.76 v93.19,2.25
  Top 0.127: v99.67,79.31 99.55,79.43 99.55,80.19 99.29,80.45 99.04,80.45 98.53,80.96 98.28,80.96 97.77,81.47 97.39,81.47 96.62,82.23 96.24,82.23 95.99,82.48 95.61,82.48 95.35,82.74 94.97,82.74 94.72,82.99 94.34,82.99 94.08,83.24 92.94,83.24 v92.43,83.75
  Bottom 0.127: v89.39,83.75 88.88,83.24 88.5,83.24 88.24,82.99 87.1,82.99 86.84,82.74 86.46,82.74 86.21,82.48 85.83,82.48 85.58,82.23 85.19,82.23 84.94,81.97 84.56,81.97 84.31,81.72 83.92,81.72 82.4,80.19 82.4,7.58 81.64,6.82 v81.64,6.69 | v90.15,83.75 89.64,83.24 89.26,83.24 89,82.99 88.62,82.99 88.37,82.74 87.23,82.74 86.97,82.48 86.59,82.48 86.34,82.23 85.96,82.23 85.7,81.97 85.32,81.97 85.07,81.72 84.69,81.72 84.43,81.47 84.05,81.47 82.65,80.07 82.65,7.46 82.15,6.95 82.15,6.19 v82.27,6.06 | v90.91,83.75 90.4,83.24 90.02,83.24 89.77,82.99 89.39,82.99 89.13,82.74 88.75,82.74 88.5,82.48 87.35,82.48 87.1,82.23 86.72,82.23 86.46,81.97 86.08,81.97 85.83,81.72 85.45,81.72 85.19,81.47 84.81,81.47 84.56,81.21 84.18,81.21 82.91,79.94 82.91,6.95 v82.65,6.69 | v91.67,83.75 91.16,83.24 90.78,83.24 90.53,82.99 90.15,82.99 89.89,82.74 89.51,82.74 89.26,82.48 88.88,82.48 88.62,82.23 87.48,82.23 87.23,81.97 86.84,81.97 86.59,81.72 86.21,81.72 85.96,81.47 85.58,81.47 85.32,81.21 84.94,81.21 84.69,80.96 84.31,80.96 83.16,79.81 83.16,6.19 v83.29,6.06 | v92.43,83.75 91.92,83.24 91.54,83.24 91.29,82.99 90.91,82.99 90.66,82.74 90.27,82.74 90.02,82.48 89.64,82.48 89.39,82.23 89,82.23 88.75,81.97 87.61,81.97 87.35,81.72 86.97,81.72 86.72,81.47 86.34,81.47 86.08,81.21 85.7,81.21 85.45,80.96 85.07,80.96 84.81,80.7 84.43,80.7 83.42,79.69 83.42,7.07 v83.8,6.69 | v88.62,83.75 88.11,83.24 86.97,83.24 86.72,82.99 86.34,82.99 86.08,82.74 85.7,82.74 85.45,82.48 85.07,82.48 84.81,82.23 84.43,82.23 84.18,81.97 83.8,81.97 82.15,80.32 82.15,7.96 81.13,6.95 81.13,6.19 v81.26,6.06
  Bottom 0.127: v91.67,2.25 92.18,2.76 92.56,2.76 92.81,3.01 93.19,3.01 93.45,3.26 94.59,3.26 94.85,3.52 95.23,3.52 95.48,3.77 95.86,3.77 96.12,4.03 96.5,4.03 96.75,4.28 97.13,4.28 98.4,5.55 98.4,78.92 98.66,79.18 v98.66,79.31 | v90.91,2.25 91.42,2.76 91.8,2.76 92.05,3.01 92.43,3.01 92.69,3.26 93.07,3.26 93.32,3.52 94.47,3.52 94.72,3.77 95.1,3.77 95.35,4.03 95.73,4.03 95.99,4.28 96.37,4.28 96.62,4.54 97,4.54 98.15,5.68 98.15,79.81 v98.02,79.94 | v90.15,2.25 90.66,2.76 91.04,2.76 91.29,3.01 91.67,3.01 91.92,3.26 92.31,3.26 92.56,3.52 92.94,3.52 93.19,3.77 94.34,3.77 94.59,4.03 94.97,4.03 95.23,4.28 95.61,4.28 95.86,4.54 96.24,4.54 96.5,4.79 96.88,4.79 97.89,5.8 97.89,79.05 v97.64,79.31 | v89.39,2.25 89.89,2.76 90.27,2.76 90.53,3.01 90.91,3.01 91.16,3.26 91.54,3.26 91.8,3.52 92.18,3.52 92.43,3.77 92.81,3.77 93.07,4.03 94.21,4.03 94.47,4.28 94.85,4.28 95.1,4.54 95.48,4.54 95.73,4.79 96.12,4.79 96.37,5.04 96.75,5.04 97.64,5.93 97.64,78.54 97.13,79.05 97.13,79.81 v97,79.94 | v88.62,2.25 89.13,2.76 89.51,2.76 89.77,3.01 90.15,3.01 90.4,3.26 90.78,3.26 91.04,3.52 91.42,3.52 91.67,3.77 92.05,3.77 92.31,4.03 92.69,4.03 92.94,4.28 94.08,4.28 94.34,4.54 94.72,4.54 94.97,4.79 95.35,4.79 95.61,5.04 95.99,5.04 96.24,5.3 96.62,5.3 97.39,6.06 97.39,78.42 96.62,79.18 v96.62,79.31 | v92.43,2.25 92.94,2.76 93.32,2.76 93.58,3.01 94.72,3.01 94.97,3.26 95.35,3.26 95.61,3.52 95.99,3.52 96.24,3.77 96.62,3.77 96.88,4.03 97.26,4.03 98.66,5.42 98.66,78.54 99.16,79.05 99.16,79.81 v99.04,79.94 | X1.1 92.69,83.24 92.31,83.24 92.05,82.99 91.67,82.99 91.42,82.74 91.04,82.74 90.78,82.48 90.4,82.48 90.15,82.23 89.77,82.23 89.51,81.97 89.13,81.97 88.88,81.72 87.73,81.72 87.48,81.47 87.1,81.47 86.84,81.21 86.46,81.21 86.21,80.96 85.83,80.96 85.58,80.7 85.19,80.7 84.94,80.45 84.56,80.45 83.67,79.56 83.67,7.58 84.31,6.95 84.31,6.19 v84.43,6.06
  Bottom 0.127: v99.67,79.31 99.67,79.18 98.91,78.42 98.91,5.3 97.39,3.77 97,3.77 96.75,3.52 96.37,3.52 96.12,3.26 95.73,3.26 95.48,3.01 95.1,3.01 94.85,2.76 93.7,2.76 v93.19,2.25
X2  (via drill 0.35 pad 0.6)
  Top 0.127: v76.56,6.69 76.69,6.57 76.69,5.8 76.94,5.55 77.32,5.55 77.83,5.04 78.21,5.04 78.72,4.54 79.1,4.54 79.35,4.28 79.73,4.28 79.99,4.03 80.37,4.03 80.62,3.77 81,3.77 81.26,3.52 82.53,3.52 82.78,3.26 83.16,3.26 83.42,3.01 83.67,3.01 83.92,2.76 84.31,2.76 v84.81,2.25 | v75.54,6.69 75.67,6.57 75.67,5.8 75.92,5.55 76.18,5.55 76.69,5.04 77.07,5.04 77.57,4.54 77.95,4.54 78.46,4.03 78.84,4.03 79.1,3.77 79.48,3.77 79.73,3.52 80.11,3.52 80.37,3.26 80.75,3.26 81,3.01 82.27,3.01 82.53,2.76 82.78,2.76 v83.29,2.25 | v75.16,6.06 75.16,5.93 75.8,5.3 76.05,5.3 76.56,4.79 76.94,4.79 77.45,4.28 77.83,4.28 78.34,3.77 78.72,3.77 78.97,3.52 79.35,3.52 79.61,3.26 79.99,3.26 80.24,3.01 80.62,3.01 80.88,2.76 82.02,2.76 v82.53,2.25 | v84.05,2.25 83.54,2.76 83.29,2.76 83.03,3.01 82.65,3.01 82.4,3.26 81.13,3.26 80.88,3.52 80.5,3.52 80.24,3.77 79.86,3.77 79.61,4.03 79.22,4.03 78.97,4.28 78.59,4.28 78.08,4.79 77.7,4.79 77.19,5.3 76.81,5.3 76.18,5.93 v76.18,6.06 | v85.58,2.25 85.07,2.76 84.69,2.76 84.43,3.01 84.05,3.01 83.8,3.26 83.54,3.26 83.29,3.52 82.91,3.52 82.65,3.77 81.38,3.77 81.13,4.03 80.75,4.03 80.5,4.28 80.11,4.28 79.86,4.54 79.48,4.54 79.22,4.79 78.84,4.79 78.34,5.3 77.95,5.3 v77.19,6.06 | v86.34,2.25 85.83,2.76 85.45,2.76 85.19,3.01 84.81,3.01 84.56,3.26 84.18,3.26 83.92,3.52 83.67,3.52 83.42,3.77 83.03,3.77 82.78,4.03 81.51,4.03 81.26,4.28 80.88,4.28 80.62,4.54 80.24,4.54 79.99,4.79 79.61,4.79 79.35,5.04 78.97,5.04 78.46,5.55 78.08,5.55 77.7,5.93 v77.7,6.69 | v90.53,79.31 90.4,79.43 90.4,80.07 89.77,80.7 89.39,80.7 89.13,80.96 88.75,80.96 88.5,81.21 88.11,81.21 87.86,81.47 87.48,81.47 87.23,81.72 86.08,81.72 85.83,81.97 85.45,81.97 85.19,82.23 84.81,82.23 84.56,82.48 84.18,82.48 83.92,82.74 83.54,82.74 83.29,82.99 82.91,82.99 82.65,83.24 82.27,83.24 81.27,84.24 75.54,84.24 75.28,84.5 69.55,84.5 69.29,84.75 63.55,84.75 63.3,85.01 57.56,85.01 57.31,85.26 51.57,85.26 51.32,85.51 45.58,85.51 45.33,85.77 39.59,85.77 39.34,86.02 33.6,86.02 31.5,88.12 31.5,88.58 31.25,88.83 IC6.2
  Top 0.127: v91.54,79.31 91.42,79.43 91.42,80.19 91.16,80.45 90.78,80.45 90.02,81.21 89.64,81.21 89.39,81.47 89,81.47 88.75,81.72 88.37,81.72 88.11,81.97 87.73,81.97 87.48,82.23 86.34,82.23 86.08,82.48 85.7,82.48 85.45,82.74 85.07,82.74 84.81,82.99 84.43,82.99 84.18,83.24 83.8,83.24 v83.29,83.75 | v92.56,79.31 92.43,79.43 92.43,80.19 92.18,80.45 91.92,80.45 91.42,80.96 91.04,80.96 90.27,81.72 89.89,81.72 89.64,81.97 89.26,81.97 89,82.23 88.62,82.23 88.37,82.48 87.99,82.48 87.73,82.74 86.59,82.74 86.34,82.99 85.96,82.99 85.7,83.24 85.32,83.24 v84.81,83.75 | v92.94,79.94 92.94,80.07 92.31,80.7 92.05,80.7 91.54,81.21 91.16,81.21 90.4,81.97 90.02,81.97 89.77,82.23 89.39,82.23 89.13,82.48 88.75,82.48 88.5,82.74 88.11,82.74 87.86,82.99 86.72,82.99 86.46,83.24 86.08,83.24 v85.58,83.75 | v84.05,83.75 84.56,83.24 84.94,83.24 85.19,82.99 85.58,82.99 85.83,82.74 86.21,82.74 86.46,82.48 87.61,82.48 87.86,82.23 88.24,82.23 88.5,81.97 88.88,81.97 89.13,81.72 89.51,81.72 89.77,81.47 90.15,81.47 90.91,80.7 91.29,80.7 91.92,80.07 v91.92,79.94 | v82.53,83.75 83.03,83.24 83.42,83.24 83.67,82.99 84.05,82.99 84.31,82.74 84.69,82.74 84.94,82.48 85.32,82.48 85.58,82.23 85.96,82.23 86.21,81.97 87.35,81.97 87.61,81.72 87.99,81.72 88.24,81.47 88.62,81.47 88.88,81.21 89.26,81.21 89.51,80.96 89.89,80.96 v90.91,79.94 | v78.34,6.06 79.1,5.3 79.48,5.3 79.73,5.04 80.11,5.04 80.37,4.79 80.75,4.79 81,4.54 81.38,4.54 81.64,4.28 82.91,4.28 83.16,4.03 83.54,4.03 83.8,3.77 84.05,3.77 84.31,3.52 84.69,3.52 84.94,3.26 85.32,3.26 85.58,3.01 85.96,3.01 86.21,2.76 86.59,2.76 v87.1,2.25
  Top 0.127: v93.58,79.31 93.45,79.43 93.45,80.19 93.19,80.45 92.94,80.45 92.43,80.96 92.18,80.96 91.67,81.47 91.29,81.47 90.53,82.23 90.15,82.23 89.89,82.48 89.51,82.48 89.26,82.74 88.88,82.74 88.62,82.99 88.24,82.99 87.99,83.24 86.84,83.24 v86.34,83.75
  Bottom 0.127: v83.29,83.75 82.78,83.24 82.4,83.24 82.15,82.99 81,82.99 80.75,82.74 80.37,82.74 80.11,82.48 79.73,82.48 79.48,82.23 79.1,82.23 78.84,81.97 78.46,81.97 78.21,81.72 77.83,81.72 76.3,80.19 76.3,7.58 75.54,6.82 v75.54,6.69 | v84.05,83.75 83.54,83.24 83.16,83.24 82.91,82.99 82.53,82.99 82.27,82.74 81.13,82.74 80.88,82.48 80.5,82.48 80.24,82.23 79.86,82.23 79.61,81.97 79.22,81.97 78.97,81.72 78.59,81.72 78.34,81.47 77.95,81.47 76.56,80.07 76.56,7.46 76.05,6.95 76.05,6.19 v76.18,6.06 | v84.81,83.75 84.31,83.24 83.92,83.24 83.67,82.99 83.29,82.99 83.03,82.74 82.65,82.74 82.4,82.48 81.26,82.48 81,82.23 80.62,82.23 80.37,81.97 79.99,81.97 79.73,81.72 79.35,81.72 79.1,81.47 78.72,81.47 78.46,81.21 78.08,81.21 76.81,79.94 76.81,6.95 v76.56,6.69 | v85.58,83.75 85.07,83.24 84.69,83.24 84.43,82.99 84.05,82.99 83.8,82.74 83.42,82.74 83.16,82.48 82.78,82.48 82.53,82.23 81.38,82.23 81.13,81.97 80.75,81.97 80.5,81.72 80.11,81.72 79.86,81.47 79.48,81.47 79.22,81.21 78.84,81.21 78.59,80.96 78.21,80.96 77.07,79.81 77.07,6.19 v77.19,6.06 | v86.34,83.75 85.83,83.24 85.45,83.24 85.19,82.99 84.81,82.99 84.56,82.74 84.18,82.74 83.92,82.48 83.54,82.48 83.29,82.23 82.91,82.23 82.65,81.97 81.51,81.97 81.26,81.72 80.88,81.72 80.62,81.47 80.24,81.47 79.99,81.21 79.61,81.21 79.35,80.96 78.97,80.96 78.72,80.7 78.34,80.7 77.32,79.69 77.32,7.07 v77.7,6.69 | v82.53,83.75 82.02,83.24 80.88,83.24 80.62,82.99 80.24,82.99 79.99,82.74 79.61,82.74 79.35,82.48 78.97,82.48 78.72,82.23 78.34,82.23 78.08,81.97 77.7,81.97 76.05,80.32 76.05,7.96 75.03,6.95 75.03,6.19 v75.16,6.06
  Bottom 0.127: v85.58,2.25 86.08,2.76 86.46,2.76 86.72,3.01 87.1,3.01 87.35,3.26 88.5,3.26 88.75,3.52 89.13,3.52 89.39,3.77 89.77,3.77 90.02,4.03 90.4,4.03 90.66,4.28 91.04,4.28 92.31,5.55 92.31,78.92 92.56,79.18 v92.56,79.31 | v84.81,2.25 85.32,2.76 85.7,2.76 85.96,3.01 86.34,3.01 86.59,3.26 86.97,3.26 87.23,3.52 88.37,3.52 88.62,3.77 89,3.77 89.26,4.03 89.64,4.03 89.89,4.28 90.27,4.28 90.53,4.54 90.91,4.54 92.05,5.68 92.05,79.81 v91.92,79.94 | v84.05,2.25 84.56,2.76 84.94,2.76 85.19,3.01 85.58,3.01 85.83,3.26 86.21,3.26 86.46,3.52 86.84,3.52 87.1,3.77 88.24,3.77 88.5,4.03 88.88,4.03 89.13,4.28 89.51,4.28 89.77,4.54 90.15,4.54 90.4,4.79 90.78,4.79 91.8,5.8 91.8,79.05 v91.54,79.31 | v83.29,2.25 83.8,2.76 84.18,2.76 84.43,3.01 84.81,3.01 85.07,3.26 85.45,3.26 85.7,3.52 86.08,3.52 86.34,3.77 86.72,3.77 86.97,4.03 88.11,4.03 88.37,4.28 88.75,4.28 89,4.54 89.39,4.54 89.64,4.79 90.02,4.79 90.27,5.04 90.66,5.04 91.54,5.93 91.54,78.54 91.04,79.05 91.04,79.81 v90.91,79.94 | v82.53,2.25 83.03,2.76 83.42,2.76 83.67,3.01 84.05,3.01 84.31,3.26 84.69,3.26 84.94,3.52 85.32,3.52 85.58,3.77 85.96,3.77 86.21,4.03 86.59,4.03 86.84,4.28 87.99,4.28 88.24,4.54 88.62,4.54 88.88,4.79 89.26,4.79 89.51,5.04 89.89,5.04 90.15,5.3 90.53,5.3 91.29,6.06 91.29,78.42 90.53,79.18 v90.53,79.31 | v86.34,2.25 86.84,2.76 87.23,2.76 87.48,3.01 88.62,3.01 88.88,3.26 89.26,3.26 89.51,3.52 89.89,3.52 90.15,3.77 90.53,3.77 90.78,4.03 91.16,4.03 92.56,5.42 92.56,78.54 93.07,79.05 93.07,79.81 v92.94,79.94 | X2.1 86.59,83.24 86.21,83.24 85.96,82.99 85.58,82.99 85.32,82.74 84.94,82.74 84.69,82.48 84.31,82.48 84.05,82.23 83.67,82.23 83.42,81.97 83.03,81.97 82.78,81.72 81.64,81.72 81.38,81.47 81,81.47 80.75,81.21 80.37,81.21 80.11,80.96 79.73,80.96 79.48,80.7 79.1,80.7 78.84,80.45 78.46,80.45 77.57,79.56 77.57,7.58 78.21,6.95 78.21,6.19 v78.34,6.06
  Bottom 0.127: v93.58,79.31 93.58,79.18 92.81,78.42 92.81,5.3 91.29,3.77 90.91,3.77 90.66,3.52 90.27,3.52 90.02,3.26 89.64,3.26 89.39,3.01 89,3.01 88.75,2.76 87.61,2.76 v87.1,2.25
X3  (via drill 0.35 pad 0.6)
  Top 0.127: v70.46,6.69 70.59,6.57 70.59,5.8 70.84,5.55 71.22,5.55 71.73,5.04 72.11,5.04 72.62,4.54 73,4.54 73.26,4.28 73.64,4.28 73.89,4.03 74.27,4.03 74.53,3.77 74.91,3.77 75.16,3.52 76.43,3.52 76.69,3.26 77.07,3.26 77.32,3.01 77.57,3.01 77.83,2.76 78.21,2.76 v78.72,2.25 | v69.45,6.69 69.57,6.57 69.57,5.8 69.83,5.55 70.08,5.55 70.59,5.04 70.97,5.04 71.48,4.54 71.86,4.54 72.37,4.03 72.75,4.03 73,3.77 73.38,3.77 73.64,3.52 74.02,3.52 74.27,3.26 74.65,3.26 74.91,3.01 76.18,3.01 76.43,2.76 76.69,2.76 v77.19,2.25 | v69.06,6.06 69.06,5.93 69.7,5.3 69.95,5.3 70.46,4.79 70.84,4.79 71.35,4.28 71.73,4.28 72.24,3.77 72.62,3.77 72.88,3.52 73.26,3.52 73.51,3.26 73.89,3.26 74.14,3.01 74.53,3.01 74.78,2.76 75.92,2.76 v76.43,2.25 | v77.95,2.25 77.45,2.76 77.19,2.76 76.94,3.01 76.56,3.01 76.3,3.26 75.03,3.26 74.78,3.52 74.4,3.52 74.14,3.77 73.76,3.77 73.51,4.03 73.13,4.03 72.88,4.28 72.49,4.28 71.99,4.79 71.61,4.79 71.1,5.3 70.72,5.3 70.08,5.93 v70.08,6.06 | v79.48,2.25 78.97,2.76 78.59,2.76 78.34,3.01 77.95,3.01 77.7,3.26 77.45,3.26 77.19,3.52 76.81,3.52 76.56,3.77 75.29,3.77 75.03,4.03 74.65,4.03 74.4,4.28 74.02,4.28 73.76,4.54 73.38,4.54 73.13,4.79 72.75,4.79 72.24,5.3 71.86,5.3 v71.1,6.06 | v80.24,2.25 79.73,2.76 79.35,2.76 79.1,3.01 78.72,3.01 78.46,3.26 78.08,3.26 77.83,3.52 77.57,3.52 77.32,3.77 76.94,3.77 76.69,4.03 75.42,4.03 75.16,4.28 74.78,4.28 74.53,4.54 74.14,4.54 73.89,4.79 73.51,4.79 73.26,5.04 72.88,5.04 72.37,5.55 71.99,5.55 71.61,5.93 v71.61,6.69 | v84.43,79.31 84.31,79.43 84.31,80.07 83.67,80.7 83.29,80.7 83.03,80.96 82.65,80.96 82.4,81.21 82.02,81.21 81.77,81.47 81.38,81.47 81.13,81.72 79.99,81.72 79.73,81.97 79.35,81.97 79.1,82.23 78.72,82.23 78.46,82.48 78.08,82.48 77.83,82.74 77.45,82.74 77.19,82.99 76.81,82.99 76.56,83.24 76.18,83.24 75.18,84.24 69.44,84.24 69.19,84.5 63.45,84.5 63.2,84.75 57.46,84.75 57.2,85.01 51.47,85.01 51.21,85.26 45.48,85.26 45.22,85.51 39.49,85.51 39.23,85.77 33.49,85.77 31.71,87.56 IC6.1
  Top 0.127: v85.45,79.31 85.32,79.43 85.32,80.19 85.07,80.45 84.69,80.45 83.92,81.21 83.54,81.21 83.29,81.47 82.91,81.47 82.65,81.72 82.27,81.72 82.02,81.97 81.64,81.97 81.38,82.23 80.24,82.23 79.99,82.48 79.61,82.48 79.35,82.74 78.97,82.74 78.72,82.99 78.34,82.99 78.08,83.24 77.7,83.24 v77.19,83.75 | v86.46,79.31 86.34,79.43 86.34,80.19 86.08,80.45 85.83,80.45 85.32,80.96 84.94,80.96 84.18,81.72 83.8,81.72 83.54,81.97 83.16,81.97 82.91,82.23 82.53,82.23 82.27,82.48 81.89,82.48 81.64,82.74 80.5,82.74 80.24,82.99 79.86,82.99 79.61,83.24 79.22,83.24 v78.72,83.75 | v86.84,79.94 86.84,80.07 86.21,80.7 85.96,80.7 85.45,81.21 85.07,81.21 84.31,81.97 83.92,81.97 83.67,82.23 83.29,82.23 83.03,82.48 82.65,82.48 82.4,82.74 82.02,82.74 81.77,82.99 80.62,82.99 80.37,83.24 79.99,83.24 v79.48,83.75 | v77.95,83.75 78.46,83.24 78.84,83.24 79.1,82.99 79.48,82.99 79.73,82.74 80.11,82.74 80.37,82.48 81.51,82.48 81.77,82.23 82.15,82.23 82.4,81.97 82.78,81.97 83.03,81.72 83.42,81.72 83.67,81.47 84.05,81.47 84.81,80.7 85.19,80.7 85.83,80.07 v85.83,79.94 | v76.43,83.75 76.94,83.24 77.32,83.24 77.57,82.99 77.95,82.99 78.21,82.74 78.59,82.74 78.84,82.48 79.22,82.48 79.48,82.23 79.86,82.23 80.11,81.97 81.26,81.97 81.51,81.72 81.89,81.72 82.15,81.47 82.53,81.47 82.78,81.21 83.16,81.21 83.42,80.96 83.8,80.96 v84.81,79.94 | v72.24,6.06 73,5.3 73.38,5.3 73.64,5.04 74.02,5.04 74.27,4.79 74.65,4.79 74.91,4.54 75.29,4.54 75.54,4.28 76.81,4.28 77.07,4.03 77.45,4.03 77.7,3.77 77.95,3.77 78.21,3.52 78.59,3.52 78.84,3.26 79.22,3.26 79.48,3.01 79.86,3.01 80.11,2.76 80.5,2.76 v81,2.25
  Top 0.127: v87.48,79.31 87.35,79.43 87.35,80.19 87.1,80.45 86.84,80.45 86.34,80.96 86.08,80.96 85.58,81.47 85.19,81.47 84.43,82.23 84.05,82.23 83.8,82.48 83.42,82.48 83.16,82.74 82.78,82.74 82.53,82.99 82.15,82.99 81.89,83.24 80.75,83.24 v80.24,83.75
  Bottom 0.127: v77.19,83.75 76.69,83.24 76.3,83.24 76.05,82.99 74.91,82.99 74.65,82.74 74.27,82.74 74.02,82.48 73.64,82.48 73.38,82.23 73,82.23 72.75,81.97 72.37,81.97 72.11,81.72 71.73,81.72 70.21,80.19 70.21,7.58 69.45,6.82 v69.45,6.69 | v77.95,83.75 77.45,83.24 77.07,83.24 76.81,82.99 76.43,82.99 76.18,82.74 75.03,82.74 74.78,82.48 74.4,82.48 74.14,82.23 73.76,82.23 73.51,81.97 73.13,81.97 72.88,81.72 72.49,81.72 72.24,81.47 71.86,81.47 70.46,80.07 70.46,7.46 69.95,6.95 69.95,6.19 v70.08,6.06 | v78.72,83.75 78.21,83.24 77.83,83.24 77.57,82.99 77.19,82.99 76.94,82.74 76.56,82.74 76.3,82.48 75.16,82.48 74.91,82.23 74.53,82.23 74.27,81.97 73.89,81.97 73.64,81.72 73.26,81.72 73,81.47 72.62,81.47 72.37,81.21 71.99,81.21 70.72,79.94 70.72,6.95 v70.46,6.69 | v79.48,83.75 78.97,83.24 78.59,83.24 78.34,82.99 77.95,82.99 77.7,82.74 77.32,82.74 77.07,82.48 76.69,82.48 76.43,82.23 75.29,82.23 75.03,81.97 74.65,81.97 74.4,81.72 74.02,81.72 73.76,81.47 73.38,81.47 73.13,81.21 72.75,81.21 72.49,80.96 72.11,80.96 70.97,79.81 70.97,6.19 v71.1,6.06 | v80.24,83.75 79.73,83.24 79.35,83.24 79.1,82.99 78.72,82.99 78.46,82.74 78.08,82.74 77.83,82.48 77.45,82.48 77.19,82.23 76.81,82.23 76.56,81.97 75.42,81.97 75.16,81.72 74.78,81.72 74.53,81.47 74.14,81.47 73.89,81.21 73.51,81.21 73.26,80.96 72.88,80.96 72.62,80.7 72.24,80.7 71.22,79.69 71.22,7.07 v71.61,6.69 | v76.43,83.75 75.92,83.24 74.78,83.24 74.53,82.99 74.14,82.99 73.89,82.74 73.51,82.74 73.26,82.48 72.88,82.48 72.62,82.23 72.24,82.23 71.99,81.97 71.61,81.97 69.95,80.32 69.95,7.96 68.94,6.95 68.94,6.19 v69.06,6.06
  Bottom 0.127: v79.48,2.25 79.99,2.76 80.37,2.76 80.62,3.01 81,3.01 81.26,3.26 82.4,3.26 82.65,3.52 83.03,3.52 83.29,3.77 83.67,3.77 83.92,4.03 84.31,4.03 84.56,4.28 84.94,4.28 86.21,5.55 86.21,78.92 86.46,79.18 v86.46,79.31 | v78.72,2.25 79.22,2.76 79.61,2.76 79.86,3.01 80.24,3.01 80.5,3.26 80.88,3.26 81.13,3.52 82.27,3.52 82.53,3.77 82.91,3.77 83.16,4.03 83.54,4.03 83.8,4.28 84.18,4.28 84.43,4.54 84.81,4.54 85.96,5.68 85.96,79.81 v85.83,79.94 | v77.95,2.25 78.46,2.76 78.84,2.76 79.1,3.01 79.48,3.01 79.73,3.26 80.11,3.26 80.37,3.52 80.75,3.52 81,3.77 82.15,3.77 82.4,4.03 82.78,4.03 83.03,4.28 83.42,4.28 83.67,4.54 84.05,4.54 84.31,4.79 84.69,4.79 85.7,5.8 85.7,79.05 v85.45,79.31 | v77.19,2.25 77.7,2.76 78.08,2.76 78.34,3.01 78.72,3.01 78.97,3.26 79.35,3.26 79.61,3.52 79.99,3.52 80.24,3.77 80.62,3.77 80.88,4.03 82.02,4.03 82.27,4.28 82.65,4.28 82.91,4.54 83.29,4.54 83.54,4.79 83.92,4.79 84.18,5.04 84.56,5.04 85.45,5.93 85.45,78.54 84.94,79.05 84.94,79.81 v84.81,79.94 | v76.43,2.25 76.94,2.76 77.32,2.76 77.57,3.01 77.95,3.01 78.21,3.26 78.59,3.26 78.84,3.52 79.22,3.52 79.48,3.77 79.86,3.77 80.11,4.03 80.5,4.03 80.75,4.28 81.89,4.28 82.15,4.54 82.53,4.54 82.78,4.79 83.16,4.79 83.42,5.04 83.8,5.04 84.05,5.3 84.43,5.3 85.19,6.06 85.19,78.42 84.43,79.18 v84.43,79.31 | v80.24,2.25 80.75,2.76 81.13,2.76 81.38,3.01 82.53,3.01 82.78,3.26 83.16,3.26 83.42,3.52 83.8,3.52 84.05,3.77 84.43,3.77 84.69,4.03 85.07,4.03 86.46,5.42 86.46,78.54 86.97,79.05 86.97,79.81 v86.84,79.94 | X3.1 80.5,83.24 80.11,83.24 79.86,82.99 79.48,82.99 79.22,82.74 78.84,82.74 78.59,82.48 78.21,82.48 77.95,82.23 77.57,82.23 77.32,81.97 76.94,81.97 76.69,81.72 75.54,81.72 75.29,81.47 74.91,81.47 74.65,81.21 74.27,81.21 74.02,80.96 73.64,80.96 73.38,80.7 73,80.7 72.75,80.45 72.37,80.45 71.48,79.56 71.48,7.58 72.11,6.95 72.11,6.19 v72.24,6.06
  Bottom 0.127: v87.48,79.31 87.48,79.18 86.72,78.42 86.72,5.3 85.19,3.77 84.81,3.77 84.56,3.52 84.18,3.52 83.92,3.26 83.54,3.26 83.29,3.01 82.91,3.01 82.65,2.76 81.51,2.76 v81,2.25
X4  (via drill 0.35 pad 0.6)